# Altium schematic sheet MCU.SchDoc: Controller
size A4; ApprovedBy: Self; CheckedBy: Self; CompanyName: TAISAT; DrawnBy: Alperen FENERCİ; Organization: IKA; SheetNumber: 4; SheetTotal: 6
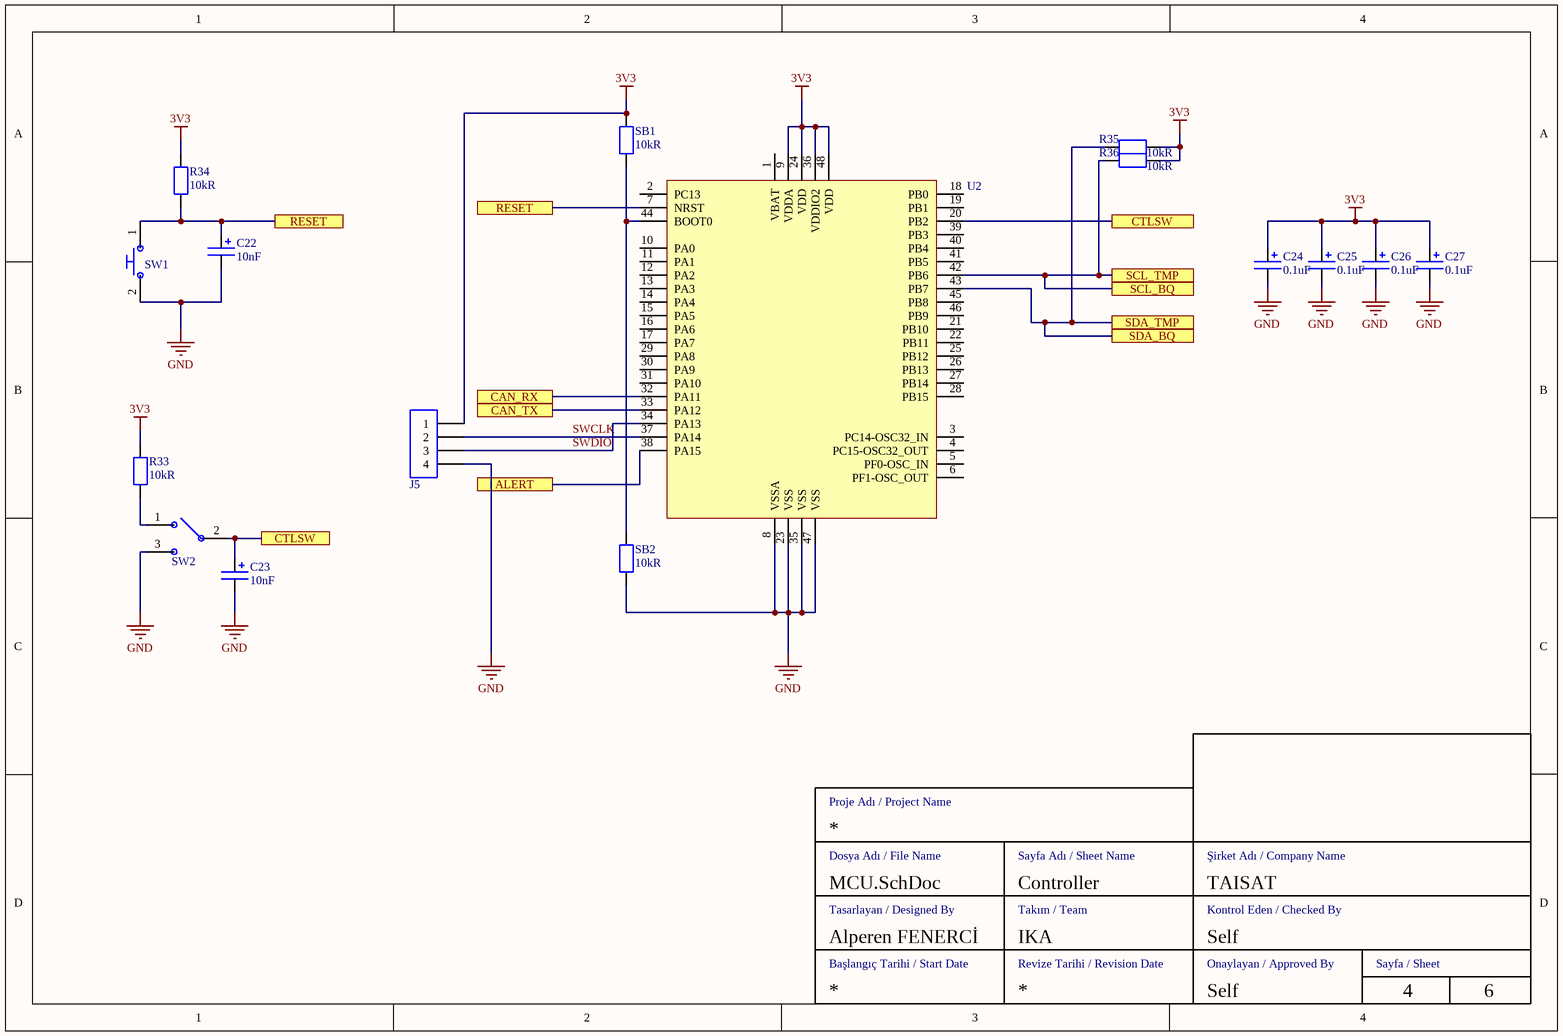
[diagram p0: MCU.SchDoc]

## Parts
C22  value 10nF  [CAP 0603]  (hidden comment: CAP 0603)
C23  value 10nF  [CAP 0603]  (hidden comment: CAP 0603)
C24  value 0.1uF  [CAP 0603]  (hidden comment: CAP 0603)
C25  value 0.1uF  [CAP 0603]  (hidden comment: CAP 0603)
C26  value 0.1uF  [CAP 0603]  (hidden comment: CAP 0603)
C27  value 0.1uF  [CAP 0603]  (hidden comment: CAP 0603)
J5  146285-4  [HMATHT00C41]  (value not drawn)
R33  value 10kR  [RESISTOR 0603]  (hidden comment: RES 0603)
R34  value 10kR  [RESISTOR 0603]  (hidden comment: RES 0603)
R35  value 10kR  [RESISTOR 0603]  (hidden comment: RES 0603)
R36  value 10kR  [RESISTOR 0603]  (hidden comment: RES 0603)
SB1  value 10kR  [RESISTOR 0603]  (hidden comment: RES 0603)
SB2  value 10kR  [RESISTOR 0603]  (hidden comment: RES 0603)
SW1  DS1042-03  [SWITCH-6X6]  (value not drawn)
SW2  L-KLS7-SS-12F20A  [SPDT]  (value not drawn)
U2  STM32F072C8  [LQFP48]  (value not drawn)

## Ports
ALERT, CAN_RX, CAN_TX, CTLSW, RESET, SCL_BQ, SCL_TMP, SDA_BQ, SDA_TMP

## Nets
3V3: C24.1 C25.1 C26.1 C27.1 J5.1 R33.2 R34.2 R35.2 R36.2 SB1.2 U2.9(VDDA) U2.24(VDD) U2.36(VDDIO2) U2.48(VDD)
GND: C22.2 C23.2 C24.2 C25.2 C26.2 C27.2 J5.4 SB2.1 SW1.2 SW2.3 U2.8(VSSA) U2.23(VSS) U2.35(VSS) U2.47(VSS)
ALERT: U2.38(PA15) ; port ALERT
CAN_RX: U2.32(PA11) ; port CAN_RX
CAN_TX: U2.33(PA12) ; port CAN_TX
CTLSW: C23.1 SW2.2 U2.20(PB2) ; port CTLSW
RESET: C22.1 R34.1 SW1.1 U2.7(NRST) ; port RESET
SCL_BQ: R36.1 U2.42(PB6) ; port SCL_BQ, port SCL_TMP
SDA_BQ: R35.1 U2.43(PB7) ; port SDA_BQ, port SDA_TMP
SWCLK: J5.2 U2.37(PA14)
SWDIO: J5.3 U2.34(PA13)
NetR33_1: R33.1 SW2.1
NetSB1_1: SB1.1 SB2.2 U2.44(BOOT0)

Not connected (* = marked no-connect by the designer): U2 1(VBAT) 2(PC13) 3(PC14-OSC32_IN) 4(PC15-OSC32_OUT) 5(PF0-OSC_IN) 6(PF1-OSC_OUT) 10(PA0) 11(PA1) 12(PA2) 13(PA3) 14(PA4) 15(PA5) 16(PA6) 17(PA7) 18(PB0) 19(PB1) 21(PB10) 22(PB11) 25(PB12) 26(PB13) 27(PB14) 28(PB15) 29(PA8) 30(PA9) 31(PA10) 39(PB3) 40(PB4) 41(PB5) 45(PB8) 46(PB9)

## Notes on the sheet
- Dosya Adı / File Name
- Proje Adı / Project Name
- Sayfa Adı / Sheet Name
- Şirket Adı / Company Name
- Tasarlayan / Designed By
- Takım / Team
- Kontrol Eden / Checked By
- Başlangıç Tarihi / Start Date
- Revize Tarihi / Revision Date
- Onaylayan / Approved By
- Sayfa / Sheet

## Library data of the parts
C22-C27 = CAP 0603: Multilayer Ceramic Capacitor; Capacitor Type: MLCC; Case/Package: 0603
J5 = HMATHT00C41: Header for PCB
R33-R36 SB1 SB2 = RES 0603: SMD Chip Resistor; Case/Package: 0603
SW1 = DS1042-03: Switch
SW2 = L-KLS7-SS-12F20A: Switch
U2 = STM32F072C8: STM32 ARM Cortex M0; Case/Package: LQFP; Pins: 48; Category: MCU